# Altium schematic sheet 3_shkb_downstream_con.SchDoc: =ProjectTitle
size A4; Address1: github.com/4pplet/SHKB; Address2: Licence: CERN-OHL-S; SheetNumber: 3; SheetTotal: 7
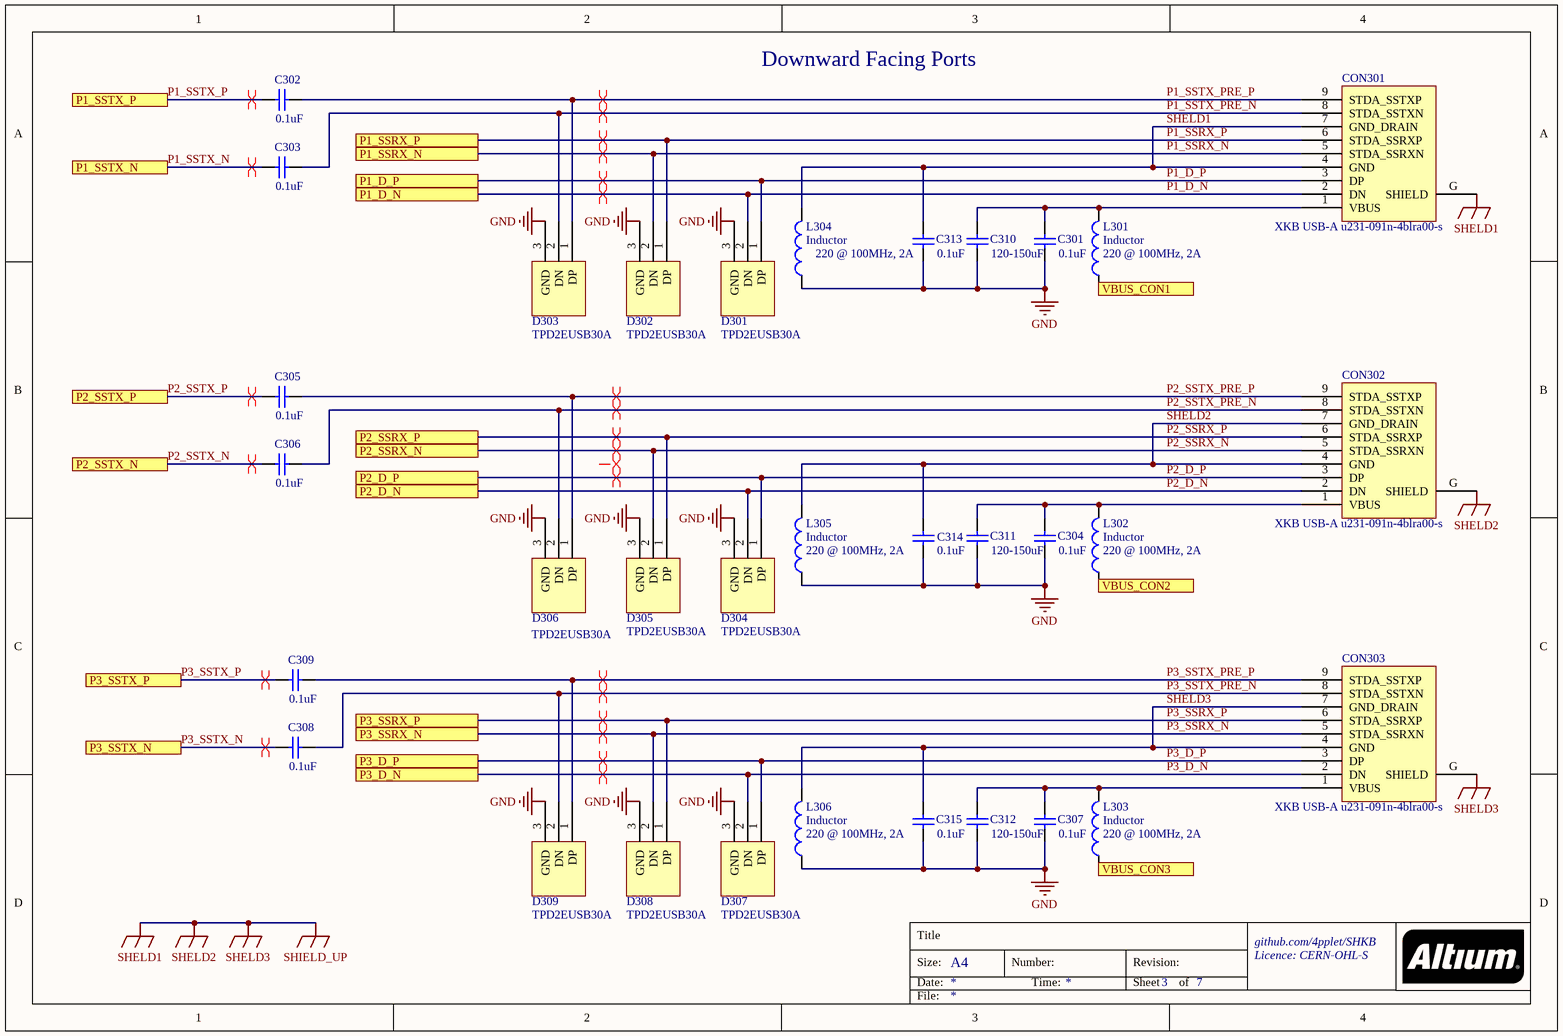
[diagram p0: 3_shkb_downstream_con.SchDoc]

## Parts
C301  value 0.1uF  [C0603[1608]]
C302  value 0.1uF  [C0402[1005]]
C303  value 0.1uF  [C0402[1005]]
C304  value 0.1uF  [C0603[1608]]
C305  value 0.1uF  [C0402[1005]]
C306  value 0.1uF  [C0402[1005]]
C307  value 0.1uF  [C0603[1608]]
C308  value 0.1uF  [C0402[1005]]
C309  value 0.1uF  [C0402[1005]]
C310  value 120-150uF  [C_9L_9M]
C311  value 120-150uF  [C_9L_9M]
C312  value 120-150uF  [C_9L_9M]
C313  value 0.1uF  [C0603[1608]]
C314  value 0.1uF  [C0603[1608]]
C315  value 0.1uF  [C0603[1608]]
CON301  XKB USB-A u231-091n-4blra00-s  [XKB USB-A u231-091n-4blra00-s]
CON302  XKB USB-A u231-091n-4blra00-s  [XKB USB-A u231-091n-4blra00-s]
CON303  XKB USB-A u231-091n-4blra00-s  [XKB USB-A u231-091n-4blra00-s]
D301  TPD2EUSB30A  [TPD2EUSB30A]
D302  TPD2EUSB30A  [TPD2EUSB30A]
D303  TPD2EUSB30A  [TPD2EUSB30A]
D304  TPD2EUSB30A  [TPD2EUSB30A]
D305  TPD2EUSB30A  [TPD2EUSB30A]
D306  TPD2EUSB30A  [TPD2EUSB30A]
D307  TPD2EUSB30A  [TPD2EUSB30A]
D308  TPD2EUSB30A  [TPD2EUSB30A]
D309  TPD2EUSB30A  [TPD2EUSB30A]
L301  Inductor  value 220 @ 100MHz, 2A  [L0603[1608]]
L302  Inductor  value 220 @ 100MHz, 2A  [L0603[1608]]
L303  Inductor  value 220 @ 100MHz, 2A  [L0603[1608]]
L304  Inductor  value 220 @ 100MHz, 2A  [L0603[1608]]
L305  Inductor  value 220 @ 100MHz, 2A  [L0603[1608]]
L306  Inductor  value 220 @ 100MHz, 2A  [L0603[1608]]

## Ports
P1_D_N, P1_D_P, P1_SSRX_N, P1_SSRX_P, P1_SSTX_N, P1_SSTX_P, P2_D_N, P2_D_P, P2_SSRX_N, P2_SSRX_P, P2_SSTX_N, P2_SSTX_P, P3_D_N, P3_D_P, P3_SSRX_N, P3_SSRX_P, P3_SSTX_N, P3_SSTX_P, VBUS_CON1, VBUS_CON2, VBUS_CON3

## Nets
GND: C301.1 C304.1 C307.1 C310.1 C311.1 C312.1 C313.1 C314.1 C315.1 D301.3(GND) D302.3(GND) D303.3(GND) D304.3(GND) D305.3(GND) D306.3(GND) D307.3(GND) D308.3(GND) D309.3(GND) L304.1 L305.1 L306.1
SHELD1: C313.2 C314.2 C315.2 CON301.4(GND) CON301.7(GND_DRAIN) CON301.G(SHIELD) CON302.4(GND) CON302.7(GND_DRAIN) CON302.G(SHIELD) CON303.4(GND) CON303.7(GND_DRAIN) CON303.G(SHIELD) L304.2 L305.2 L306.2  [also labelled SHELD2, SHELD3, SHIELD_UP]
P1_D_N: CON301.2(DN) D301.2(DN) ; port P1_D_N
P1_D_P: CON301.3(DP) D301.1(DP) ; port P1_D_P
P1_SSRX_N: CON301.5(STDA_SSRXN) D302.2(DN) ; port P1_SSRX_N
P1_SSRX_P: CON301.6(STDA_SSRXP) D302.1(DP) ; port P1_SSRX_P
P1_SSTX_N: C303.2 ; port P1_SSTX_N
P1_SSTX_P: C302.2 ; port P1_SSTX_P
P1_SSTX_PRE_N: C303.1 CON301.8(STDA_SSTXN) D303.2(DN)
P1_SSTX_PRE_P: C302.1 CON301.9(STDA_SSTXP) D303.1(DP)
P2_D_N: CON302.2(DN) D304.2(DN) ; port P2_D_N
P2_D_P: CON302.3(DP) D304.1(DP) ; port P2_D_P
P2_SSRX_N: CON302.5(STDA_SSRXN) D305.2(DN) ; port P2_SSRX_N
P2_SSRX_P: CON302.6(STDA_SSRXP) D305.1(DP) ; port P2_SSRX_P
P2_SSTX_N: C306.1 ; port P2_SSTX_N
P2_SSTX_P: C305.1 ; port P2_SSTX_P
P2_SSTX_PRE_N: C306.2 CON302.8(STDA_SSTXN) D306.2(DN)
P2_SSTX_PRE_P: C305.2 CON302.9(STDA_SSTXP) D306.1(DP)
P3_D_N: CON303.2(DN) D307.2(DN) ; port P3_D_N
P3_D_P: CON303.3(DP) D307.1(DP) ; port P3_D_P
P3_SSRX_N: CON303.5(STDA_SSRXN) D308.2(DN) ; port P3_SSRX_N
P3_SSRX_P: CON303.6(STDA_SSRXP) D308.1(DP) ; port P3_SSRX_P
P3_SSTX_N: C308.1 ; port P3_SSTX_N
P3_SSTX_P: C309.1 ; port P3_SSTX_P
P3_SSTX_PRE_N: C308.2 CON303.8(STDA_SSTXN) D309.2(DN)
P3_SSTX_PRE_P: C309.2 CON303.9(STDA_SSTXP) D309.1(DP)
VBUS_CON1: L301.1 ; port VBUS_CON1
VBUS_CON2: L302.1 ; port VBUS_CON2
VBUS_CON3: L303.1 ; port VBUS_CON3
NetC301_2: C301.2 C310.2 CON301.1(VBUS) L301.2
NetC304_2: C304.2 C311.2 CON302.1(VBUS) L302.2
NetC307_2: C307.2 C312.2 CON303.1(VBUS) L303.2

## Layout directives
differential pair: (no net found under the mark), P1_D_N, P1_D_P, P1_SSRX_N, P1_SSRX_P, P1_SSTX_N, P1_SSTX_P, P1_SSTX_PRE_N, P1_SSTX_PRE_P, P2_D_P, P2_SSRX_N, P2_SSRX_P, P2_SSTX_N, P2_SSTX_P, P2_SSTX_PRE_N, P2_SSTX_PRE_P, P3_D_N, P3_D_P, P3_SSRX_N, P3_SSRX_P, P3_SSTX_N, P3_SSTX_P, P3_SSTX_PRE_N, P3_SSTX_PRE_P

## Notes on the sheet
- Downward Facing Ports
- Title
- Size:
- Date:
- A4
- Number:
- Time:
- Revision:
- Sheet
- of
- File:

## Library data of the parts
C301 C304 C307 C313-C315 = Cap: Capacitor; MRF.Part: CC0603KRX7R9BB104; MFG: KEMET; MFGPN: C0603C104M5RACTU; LCSC MFG: YAGEO; Version: 0603 imperial; JLC: BASIC; LCSC Part #: C14663
C302 C303 C305 C306 C308 C309 = Cap: Capacitor; MRF.Part: CL05B104KO5NNNC; MFG: KEMET; MFGPN: C0402C104K8PACTU; LCSC MFG: Samsung Electro-Mechanics; Version: 0402 imperial; JLC: BASIC; LCSC Part #: C1525
C310-C312 = Cap: Capacitor; MRF.Part: XT100UF16V90RV0074; LCSC MFG: KNSCHA; Version: SMD - 9L or 9M; JLC: EXTENDED; LCSC Part #: C2992605
CON301-CON303 = XKB USB-A u231-091n-4blra00-s: MRF.Part: U231-091N-4BLRA00-S-1; LCSC MFG: XKB Connectivity; LCSC Part #: C381140; JLC: NONE
D301-D305 D307-D309 = TPD2EUSB30A: MRF.Part: TPD2EUSB30DRTR-TP; MFG: Texas Instruments; MFGPN: TPD2EUSB30ADRTR; LCSC MFG: TECH PUBLIC; LCSC Part #: C2844720; JLC: NONE
D306 = TPD2EUSB30A: MRF.Part: TPD2EUSB30DRTR-TP; MFGPN: TPD2EUSB30ADRTR; MFG: Texas Instruments; LCSC MFG: TECH PUBLIC; LCSC Part #: C2844720; JLC: NONE
L301-L306 = Inductor: MRF.Part: BLM18KG331SN1D; MFG: Murata Electronics North America; MFGPN: BLM18KG221SN1D; LCSC MFG: Murata Electronics; Version: 0603 imperial; JLC: EXTENDED; LCSC Part #: C85832